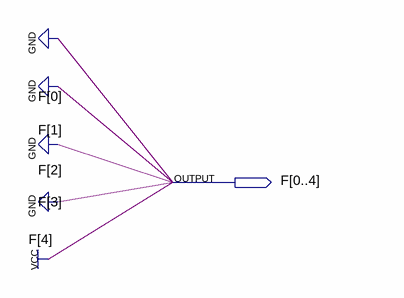
[diagram p0: schematic sheet]
// Quartus schematic constante.bdf as structural Verilog: 0 symbols, 1 pins
module constante (
  output [0:4] F
);


  assign F = {5{1'b1}};
endmodule
